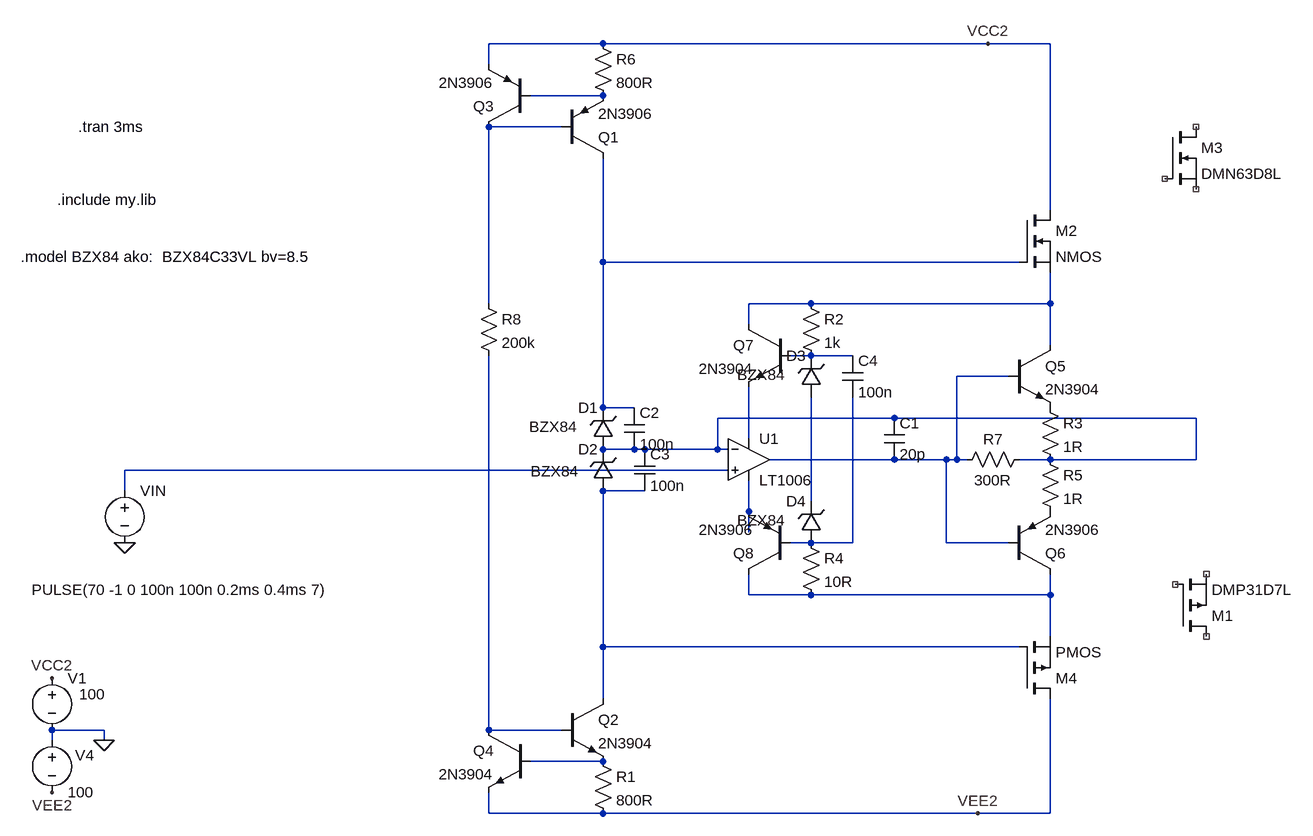
[diagram p0: schematic Draft02.asc]
Draft02.asc, the LTspice schematic file:
Version 4
SHEET 1 2336 896
WIRE 704 -416 528 -416
WIRE 1296 -416 704 -416
WIRE 1392 -416 1296 -416
WIRE 528 -384 528 -416
WIRE 704 -336 592 -336
WIRE 640 -288 528 -288
WIRE 1392 -160 1392 -416
WIRE 704 -80 704 -240
WIRE 1344 -80 704 -80
WIRE 528 -16 528 -288
WIRE 1024 -16 928 -16
WIRE 1392 -16 1392 -64
WIRE 1392 -16 1024 -16
WIRE 928 16 928 -16
WIRE 1392 48 1392 -16
WIRE 1024 64 992 64
WIRE 1088 64 1024 64
WIRE 1328 96 1248 96
WIRE 704 144 704 -80
WIRE 752 144 704 144
WIRE 1152 160 880 160
WIRE 1616 160 1152 160
WIRE 928 192 928 112
WIRE 752 208 704 208
WIRE 768 208 752 208
WIRE 880 208 880 160
WIRE 880 208 768 208
WIRE 896 208 880 208
WIRE 1152 224 960 224
WIRE 1232 224 1152 224
WIRE 1248 224 1248 96
WIRE 1248 224 1232 224
WIRE 1264 224 1248 224
WIRE 1392 224 1344 224
WIRE 1616 224 1616 160
WIRE 1616 224 1392 224
WIRE 896 240 -32 240
WIRE -32 272 -32 240
WIRE 768 272 704 272
WIRE 1024 288 1024 128
WIRE 928 304 928 256
WIRE 928 336 928 304
WIRE 1024 352 992 352
WIRE 1088 352 1088 128
WIRE 1088 352 1024 352
WIRE 1232 352 1232 224
WIRE 1328 352 1232 352
WIRE 928 432 928 400
WIRE 1024 432 928 432
WIRE 1392 432 1392 400
WIRE 1392 432 1024 432
WIRE 1392 496 1392 432
WIRE 704 512 704 272
WIRE 1344 512 704 512
WIRE 704 592 704 512
WIRE -64 640 -144 640
WIRE 528 640 528 64
WIRE 640 640 528 640
WIRE -144 656 -144 640
WIRE -64 656 -64 640
WIRE 704 688 592 688
WIRE 528 768 528 736
WIRE 704 768 528 768
WIRE 1280 768 704 768
WIRE 1392 768 1392 592
WIRE 1392 768 1280 768
FLAG -32 352 0
FLAG -64 656 0
FLAG -144 560 VCC2
FLAG -144 736 VEE2
FLAG 1296 -416 VCC2
FLAG 1280 768 VEE2
SYMBOL voltage -32 256 R0
WINDOW 123 0 0 Left 0
WINDOW 39 0 0 Left 0
WINDOW 3 -143 168 Left 2
SYMATTR Value PULSE(70 -1 0 100n 100n 0.2ms 0.4ms 7)
SYMATTR InstName VIN
SYMBOL pnp 640 -240 M180
SYMATTR InstName Q1
SYMATTR Value 2N3906
SYMBOL pnp 592 -288 R180
SYMATTR InstName Q3
SYMATTR Value 2N3906
SYMBOL res 688 -432 R0
SYMATTR InstName R6
SYMATTR Value 800R
SYMBOL voltage -144 544 R0
WINDOW 123 0 0 Left 0
WINDOW 39 0 0 Left 0
WINDOW 3 42 41 Left 2
SYMATTR Value 100
SYMATTR InstName V1
SYMBOL voltage -144 640 R0
WINDOW 123 0 0 Left 0
WINDOW 39 0 0 Left 0
WINDOW 0 36 39 Left 2
SYMATTR InstName V4
SYMATTR Value 100
SYMBOL res 512 -32 R0
SYMATTR InstName R8
SYMATTR Value 200k
SYMBOL zener 720 208 R180
WINDOW 0 24 64 Left 2
WINDOW 3 56 35 Left 2
SYMATTR InstName D1
SYMATTR Value BZX84
SYMBOL zener 720 272 R180
WINDOW 0 24 64 Left 2
WINDOW 3 54 30 Left 2
SYMATTR InstName D2
SYMATTR Value BZX84
SYMBOL npn 640 592 R0
SYMATTR InstName Q2
SYMATTR Value 2N3904
SYMBOL res 688 672 R0
SYMATTR InstName R1
SYMATTR Value 800R
SYMBOL npn 592 640 M0
SYMATTR InstName Q4
SYMATTR Value 2N3904
SYMBOL npn 1328 48 R0
SYMATTR InstName Q5
SYMATTR Value 2N3904
SYMBOL pnp 1328 400 M180
SYMATTR InstName Q6
SYMATTR Value 2N3906
SYMBOL res 1376 128 R0
SYMATTR InstName R3
SYMATTR Value 1R
SYMBOL res 1376 208 R0
SYMATTR InstName R5
SYMATTR Value 1R
SYMBOL res 1360 208 R90
WINDOW 0 0 56 VBottom 2
WINDOW 3 32 56 VTop 2
SYMATTR InstName R7
SYMATTR Value 300R
SYMBOL nmos 1568 -288 R0
SYMATTR InstName M3
SYMATTR Value DMN63D8L
SYMATTR Prefix X
SYMBOL pmos 1584 496 M180
SYMATTR InstName M1
SYMATTR Value DMP31D7L
SYMATTR Prefix X
SYMBOL nmos 1344 -160 R0
SYMATTR InstName M2
SYMBOL pmos 1344 592 M180
SYMATTR InstName M4
SYMBOL OpAmps\\LT1006 928 160 R0
SYMATTR InstName U1
SYMBOL cap 1136 160 R0
SYMATTR InstName C1
SYMATTR Value 20p
SYMBOL cap 736 144 R0
SYMATTR InstName C2
SYMATTR Value 100n
SYMBOL cap 752 208 R0
SYMATTR InstName C3
SYMATTR Value 100n
SYMBOL npn 992 16 M0
SYMATTR InstName Q7
SYMATTR Value 2N3904
SYMBOL pnp 992 400 R180
SYMATTR InstName Q8
SYMATTR Value 2N3906
SYMBOL res 1008 -32 R0
SYMATTR InstName R2
SYMATTR Value 1k
SYMBOL res 1008 336 R0
SYMATTR InstName R4
SYMATTR Value 10R
SYMBOL zener 1040 128 R180
WINDOW 0 24 64 Left 2
WINDOW 3 56 35 Left 2
SYMATTR InstName D3
SYMATTR Value BZX84
SYMBOL zener 1040 352 R180
WINDOW 0 24 64 Left 2
WINDOW 3 56 35 Left 2
SYMATTR InstName D4
SYMATTR Value BZX84
SYMBOL cap 1072 64 R0
SYMATTR InstName C4
SYMATTR Value 100n
TEXT -104 -288 Left 2 !.tran 3ms
TEXT -136 -176 Left 2 !.include my.lib
TEXT -192 -88 Left 2 !.model BZX84 ako:  BZX84C33VL bv=8.5

The netlist it stands for:
* Draft02.asc
VIN N009 0 PULSE(70 -1 0 100n 100n 0.2ms 0.4ms 7)
Q1 N003 N002 N001 0 2N3906
Q3 N002 N001 VCC2 0 2N3906
R6 VCC2 N001 800R
V1 VCC2 0 100
V4 0 VEE2 100
R8 N002 N015 200k
D1 N007 N003 BZX84
D2 N010 N007 BZX84
Q2 N010 N015 N016 0 2N3904
R1 N016 VEE2 800R
Q4 N015 N016 VEE2 0 2N3904
Q5 N004 N006 P001 0 2N3904
Q6 N014 N006 P002 0 2N3906
R3 P001 N007 1R
R5 N007 P002 1R
R7 N007 N006 300R
XM3 NC_01 NC_02 NC_03 DMN63D8L  ; pins D G S
XM1 NC_04 NC_05 NC_06 DMP31D7L  ; pins D G S
M2 VCC2 N003 N004 N004 NMOS
M4 VEE2 N010 N014 N014 PMOS
XU1 N009 N007 N008 N012 N006 LT1006  ; pins In+ In- V+ V- OUT
C1 N007 N006 20p
C2 N003 N007 100n
C3 N007 N010 100n
Q7 N004 N005 N008 0 2N3904
Q8 N014 N013 N012 0 2N3906
R2 N004 N005 1k
R4 N013 N014 10R
D3 N011 N005 BZX84
D4 N013 N011 BZX84
C4 N005 N013 100n
.model D D
.lib standard.dio
.model NPN NPN
.model PNP PNP
.lib standard.bjt
.model NMOS NMOS
.model PMOS PMOS
.lib standard.mos
.tran 3ms
.include my.lib
.model BZX84 ako:  BZX84C33VL bv=8.5
.lib LTC.lib
.backanno
.end